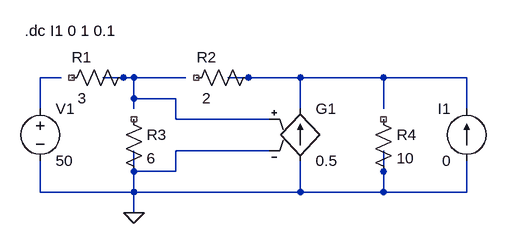
[diagram p0: schematic Ex_04_79.asc]
Ex_04_79.asc, the LTspice schematic file:
Version 4.1
SHEET 1 880 680
WIRE -16 80 -48 80
WIRE 96 80 48 80
WIRE 176 80 96 80
WIRE 352 80 240 80
WIRE 480 80 352 80
WIRE 608 80 480 80
WIRE 96 112 96 80
WIRE 160 112 96 112
WIRE -48 128 -48 80
WIRE 96 128 96 112
WIRE 352 128 352 80
WIRE 480 128 480 80
WIRE 608 128 608 80
WIRE 160 144 160 112
WIRE 304 144 160 144
WIRE 304 192 160 192
WIRE 96 224 96 192
WIRE 160 224 160 192
WIRE 160 224 96 224
WIRE -48 256 -48 208
WIRE 96 256 96 224
WIRE 96 256 -48 256
WIRE 352 256 352 208
WIRE 352 256 96 256
WIRE 480 256 480 192
WIRE 480 256 352 256
WIRE 608 256 608 208
WIRE 608 256 480 256
WIRE 96 288 96 256
FLAG 96 288 0
SYMBOL voltage -48 112 R0
WINDOW 123 0 0 Left 0
WINDOW 39 0 0 Left 0
SYMATTR InstName V1
SYMATTR Value 50
SYMBOL res -16 96 R270
WINDOW 0 32 32 VTop 2
WINDOW 3 0 32 VBottom 2
SYMATTR InstName R1
SYMATTR Value 3
SYMBOL res 176 96 R270
WINDOW 0 32 32 VTop 2
WINDOW 3 0 32 VBottom 2
SYMATTR InstName R2
SYMATTR Value 2
SYMBOL res 80 128 R0
SYMATTR InstName R3
SYMATTR Value 6
SYMBOL res 464 128 R0
SYMATTR InstName R4
SYMATTR Value 10
SYMBOL current 608 208 R180
WINDOW 0 24 80 Left 2
WINDOW 3 24 0 Left 2
WINDOW 123 0 0 Left 0
WINDOW 39 0 0 Left 0
SYMATTR InstName I1
SYMATTR Value 0
SYMBOL g 352 112 R0
SYMATTR InstName G1
SYMATTR Value 0.5
TEXT -72 8 Left 2 !.dc I1 0 1 0.1

The netlist it stands for:
* Ex_04_79.asc
V1 N001 0 50
R1 NC_01 N002 3
R2 NC_02 N003 2
R3 NC_03 0 6
R4 NC_04 0 10
I1 0 N003 0
G1 0 N003 N002 0 0.5
.dc I1 0 1 0.1
.backanno
.end